# EAGLE schematic Power Supply Block Diagram (EAGLE 9.2.2)
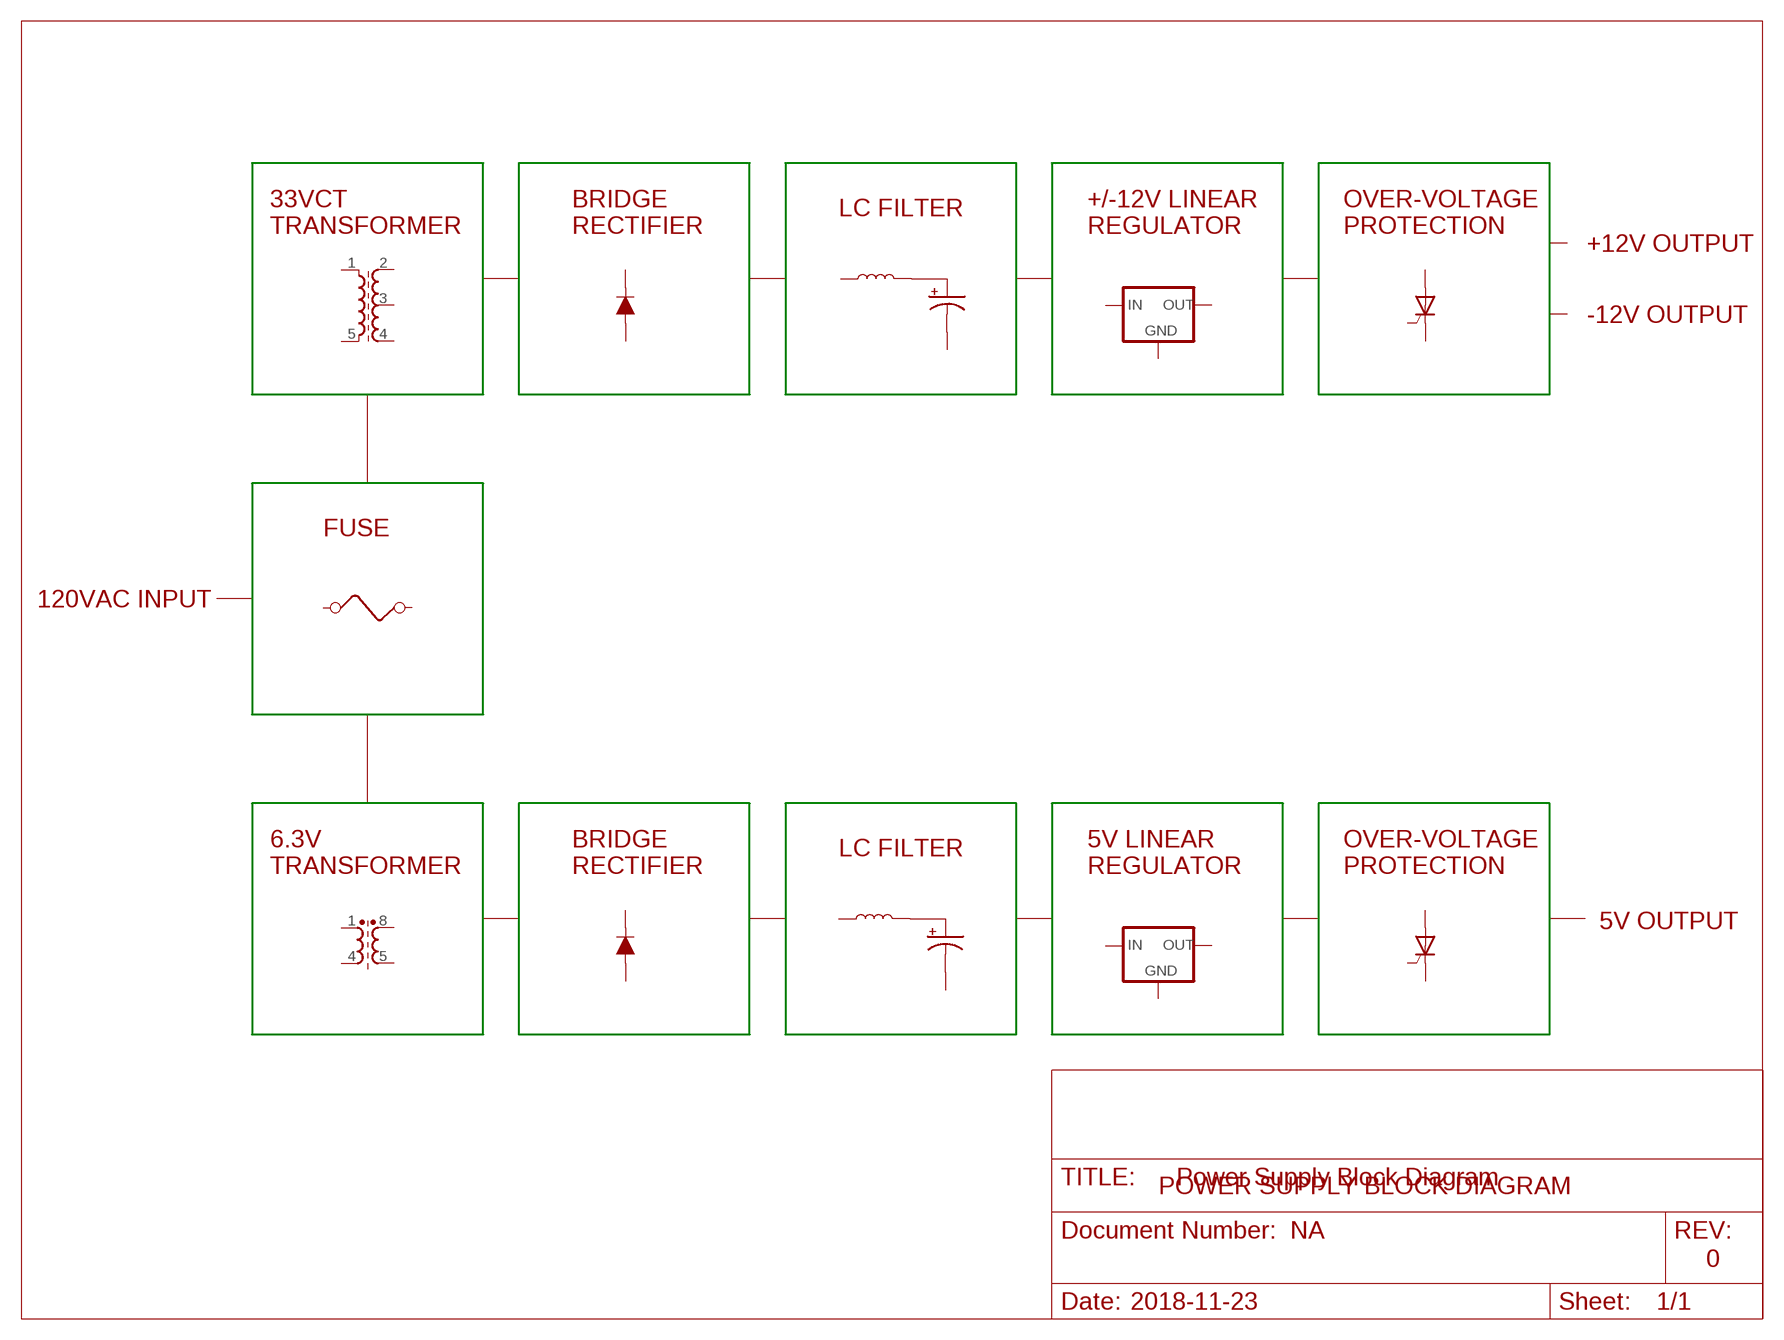
[diagram p0: schematic, sheet 1]

## Parts
C1  100uF  100UF-POLAR-25V-20%(ELEC)  [PANASONIC_D]
C2  100uF  100UF-POLAR-25V-20%(ELEC)  [PANASONIC_D]
D1  200mA/100V/1V  DIODE-1N4148  [DIODE-1N4148]
D2  200mA/100V/1V  DIODE-1N4148  [DIODE-1N4148]
F1  FUSE  [FUSE]
L1  INDUCTOR  [XFL4020]
L2  INDUCTOR  [XFL4020]
T1  BRX44  [SOT54]
T3  BRX44  [SOT54]
TR1  MS40A  [MS40]
TR3  SMR6-2W  [SM-R6]
U2  R-78E5.0-1.0  [DC-DC_CONVERTER_78XX]
U3  R-78E5.0-1.0  [DC-DC_CONVERTER_78XX]
Unconnected: C1.+ C1.- C2.+ C2.- D1.A D1.C D2.A D2.C F1.1 F1.2 L1.P$1 L1.P$2 L2.P$1 L2.P$2 T1.A T1.C T1.G T3.A T3.C T3.G TR1.1 TR1.2 TR1.3 TR1.4 TR1.5 TR3.1 TR3.4 TR3.5 TR3.8 U2.GND U2.VIN(IN) U2.VOUT(OUT) U3.GND U3.VIN(IN) U3.VOUT(OUT)

## Notes on the sheet
- LC FILTER
- 33VCT 
  TRANSFORMER
- BRIDGE
  RECTIFIER
- +/-12V LINEAR
  REGULATOR
- OVER-VOLTAGE
  PROTECTION
- +12V OUTPUT
- -12V OUTPUT
- FUSE
- 120VAC INPUT
- LC FILTER
- 6.3V
  TRANSFORMER
- BRIDGE
  RECTIFIER
- 5V LINEAR
  REGULATOR
- OVER-VOLTAGE
  PROTECTION
- 5V OUTPUT
- POWER SUPPLY BLOCK DIAGRAM
- NA
- 0
- 2018-11-23

## Library data of the parts
C1 C2 = SparkFun-Capacitors:100UF-POLAR: 100µF polarized capacitors A capacitor is a passive two-terminal electrical component used to store electrical energy temporarily in an electric field.; PROD_ID: CAP-12547
D1 D2 = SparkFun-DiscreteSemi:DIODE: Diode These are standard reverse protection diodes and small signal diodes. SparkFun Products: SparkFun SparkPunk Sound Kit <https://www.sparkfun.com/products/11177> SparkFun ESP8266 Thing <https://www.sparkfun.com/products/13231>; PROD_ID: DIO-08378
F1 = special:FUSE: FUSE 5 x 20 mm
L1 L2 = SparkFun-Coils:INDUCTOR: Inductors Resist changes in electrical current. Basically a coil of wire. SparkFun Products: SparkFun Load Cell Amplifier - HX711 <https://www.sparkfun.com/products/13879> IOIO-OTG - V2.2 <https://www.sparkfun.com/products/13613>
T1 T3 = triac:BRX4*: THYRISTOR
TR1 = inductor-neosid:MS40: TRANSFORMER SMD transformer acc. to customer specification; OC_FARNELL: unknown; OC_NEWARK: unknown
TR3 = inductor-neosid:SMR6-2W: TRANSFORMER SMD toroidal-core transformer with 2 windings; OC_FARNELL: unknown; OC_NEWARK: unknown
U2 U3 = SparkFun-IC-Power:R-78E5.0-1.0: Recom Power 5V 1A DC/DC Converter The Recom R-78E5.0-X.X is a compact DC/DC converter module that is a pin for pin drop-in replacement for the LM7805 linear voltage regulator. Specifications: Input Range: 7-28V Output Voltage: 5V Output Current: 1A Max Efficiency: 91% Datasheet <https://www.recom-power.com/pdf/Innoline/R-78Exx-1.0.pdf>; PROD_ID: COM-13655